# EAGLE schematic raspirepcol (EAGLE 6.2)
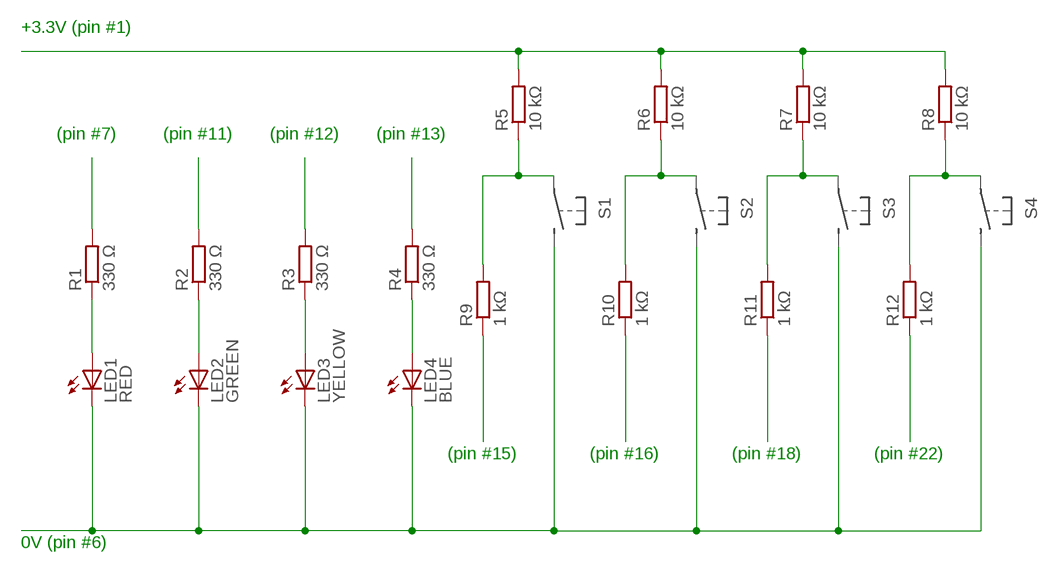
[diagram p0: schematic, sheet 1]

## Parts
LED1  RED  LAP4-BOTTOM  [P47F-BOTTOM]
LED2  GREEN  LAP4-BOTTOM  [P47F-BOTTOM]
LED3  YELLOW  LAP4-BOTTOM  [P47F-BOTTOM]
LED4  BLUE  LAP4-BOTTOM  [P47F-BOTTOM]
R1  330 Ω  R-EU_0204/2V  [0204V]
R2  330 Ω  R-EU_0204/2V  [0204V]
R3  330 Ω  R-EU_0204/2V  [0204V]
R4  330 Ω  R-EU_0204/2V  [0204V]
R5  10 kΩ  R-EU_0204/2V  [0204V]
R6  10 kΩ  R-EU_0204/2V  [0204V]
R7  10 kΩ  R-EU_0204/2V  [0204V]
R8  10 kΩ  R-EU_0204/2V  [0204V]
R9  1 kΩ  R-EU_0204/2V  [0204V]
R10  1 kΩ  R-EU_0204/2V  [0204V]
R11  1 kΩ  R-EU_0204/2V  [0204V]
R12  1 kΩ  R-EU_0204/2V  [0204V]

## Nets
N$1: R5.2 R6.2 R7.2 R8.2
N$2: R5.1 R9.2
N$3: LED1.A R1.1
N$4: R1.2
N$5: LED2.A R2.1
N$6: LED3.A R3.1
N$7: LED4.A R4.1
N$8: R2.2
N$9: R3.2
N$10: R4.2
N$11: R6.1 R10.2
N$12: R7.1 R11.2
N$13: R8.1 R12.2
N$14: LED1.C LED2.C LED3.C LED4.C
N$22: R9.1
N$23: R10.1
N$24: R11.1
N$25: R12.1

## Notes on the sheet
- +3.3V (pin #1)
- (pin #7) | (pin #11) | (pin #12) | (pin #13)
- (pin #15) | (pin #16) | (pin #18) | (pin #22)
- 0V (pin #6)

## Library data of the parts
LED1-LED4 = led:*P4: PointLED® Enhanced Thinfilm LED TOP & BOTTOM mount LS P47F, LR P47F, LA P47F, LY P47F, LT P4SG, LB P4SG, LW P4SG Source: http://catalog.osram-os.com .. LA_LR_LS_LY_P47F_Pb_free.pdf
R1-R12 = rcl:R-EU_: RESISTOR, European symbol